# Altium schematic sheet tempSensor_master.SchDoc
size A4
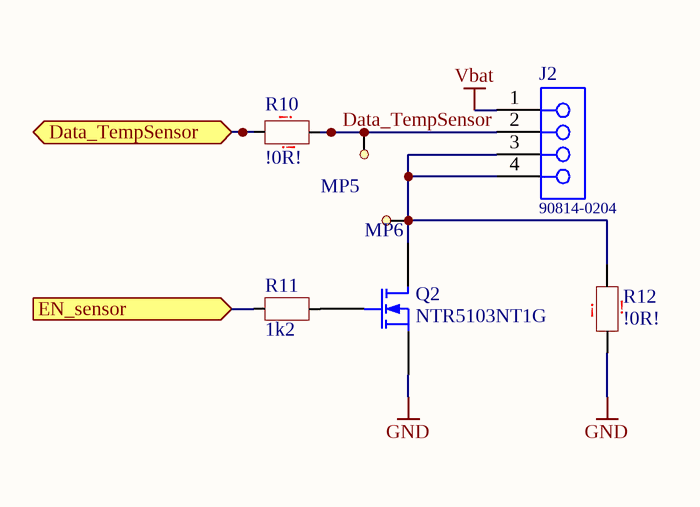
[diagram p0: tempSensor_master.SchDoc]

## Parts
J2  90814-0204  [MOLEX_90814-0204]
MP5  Measure_point  [MeasurePoint_1.5mm]  (value not drawn)  (no BOM)
MP6  Measure_point  [MeasurePoint_1.5mm]  (value not drawn)  (no BOM)
Q2  NTR5103NT1G  [SOT23]
R10  !0R!  [R1206_Simple-Assemble]  (no BOM)
R11  1k2  [R1206_Simple-Assemble]
R12  !0R!  [R1206_Simple-Assemble]  (no BOM)

## Ports
Data_TempSensor (bidir), EN_sensor (in)

## Nets
GND: Q2.2(S) R12.1
Vbat: J2.1
Data_TempSensor: J2.2 MP5.1 R10.2
Data_TempSensor: R10.1 ; port Data_TempSensor  [a separate net that carries the same name]
EN_sensor: R11.1 ; port EN_sensor
NetJ2_3: J2.3 J2.4 MP6.1 Q2.3(D) R12.2
NetQ2_1: Q2.1(G) R11.2

## Notes on the sheet
- (in symbol 0R, optional resistor) !

## Library data of the parts
J2 = 90814-0204: Pin Header, Signal, 1.27 mm, 1 Rows, 4 Contacts, Surface Mount Straight, Picoflex 90814 Series; Manufacturer: MOLEX; Manufacturer Part Number: 90814-0204
MP5 MP6 = Measure_point: Measurepoint
Q2 = NTR5103NT1G: Power MOSFET, N Channel, 60 V, 260 mA, 1 ohm, SOT-23, Surface Mount; Manufacturer: ON Semiconductor; Manufacturer Part Number: NTR5103NT1G
R10 R12 = 0R, optional resistor: normally shorted, but easy to change to an resistor footprint
R11 = 1k2, 1206: SMD Chip Resistor, 1206 [3216 Metric], 1 kohm, MCSR 12 Series, 200 V, Ceramic, 250 mW; Brand: MULTICOMP; Order Code: 2446791; Power: 250mW; Resistance: 1k2; Type: MCWR12X1201FTL; Supplier: Farnell; Price: 0,0298